# Altium schematic sheet Power.SchDoc: M1 Test Fixture Board
size Legal; Author: Leo Buchman; Revision: B; SheetNumber: 4; SheetTotal: 4
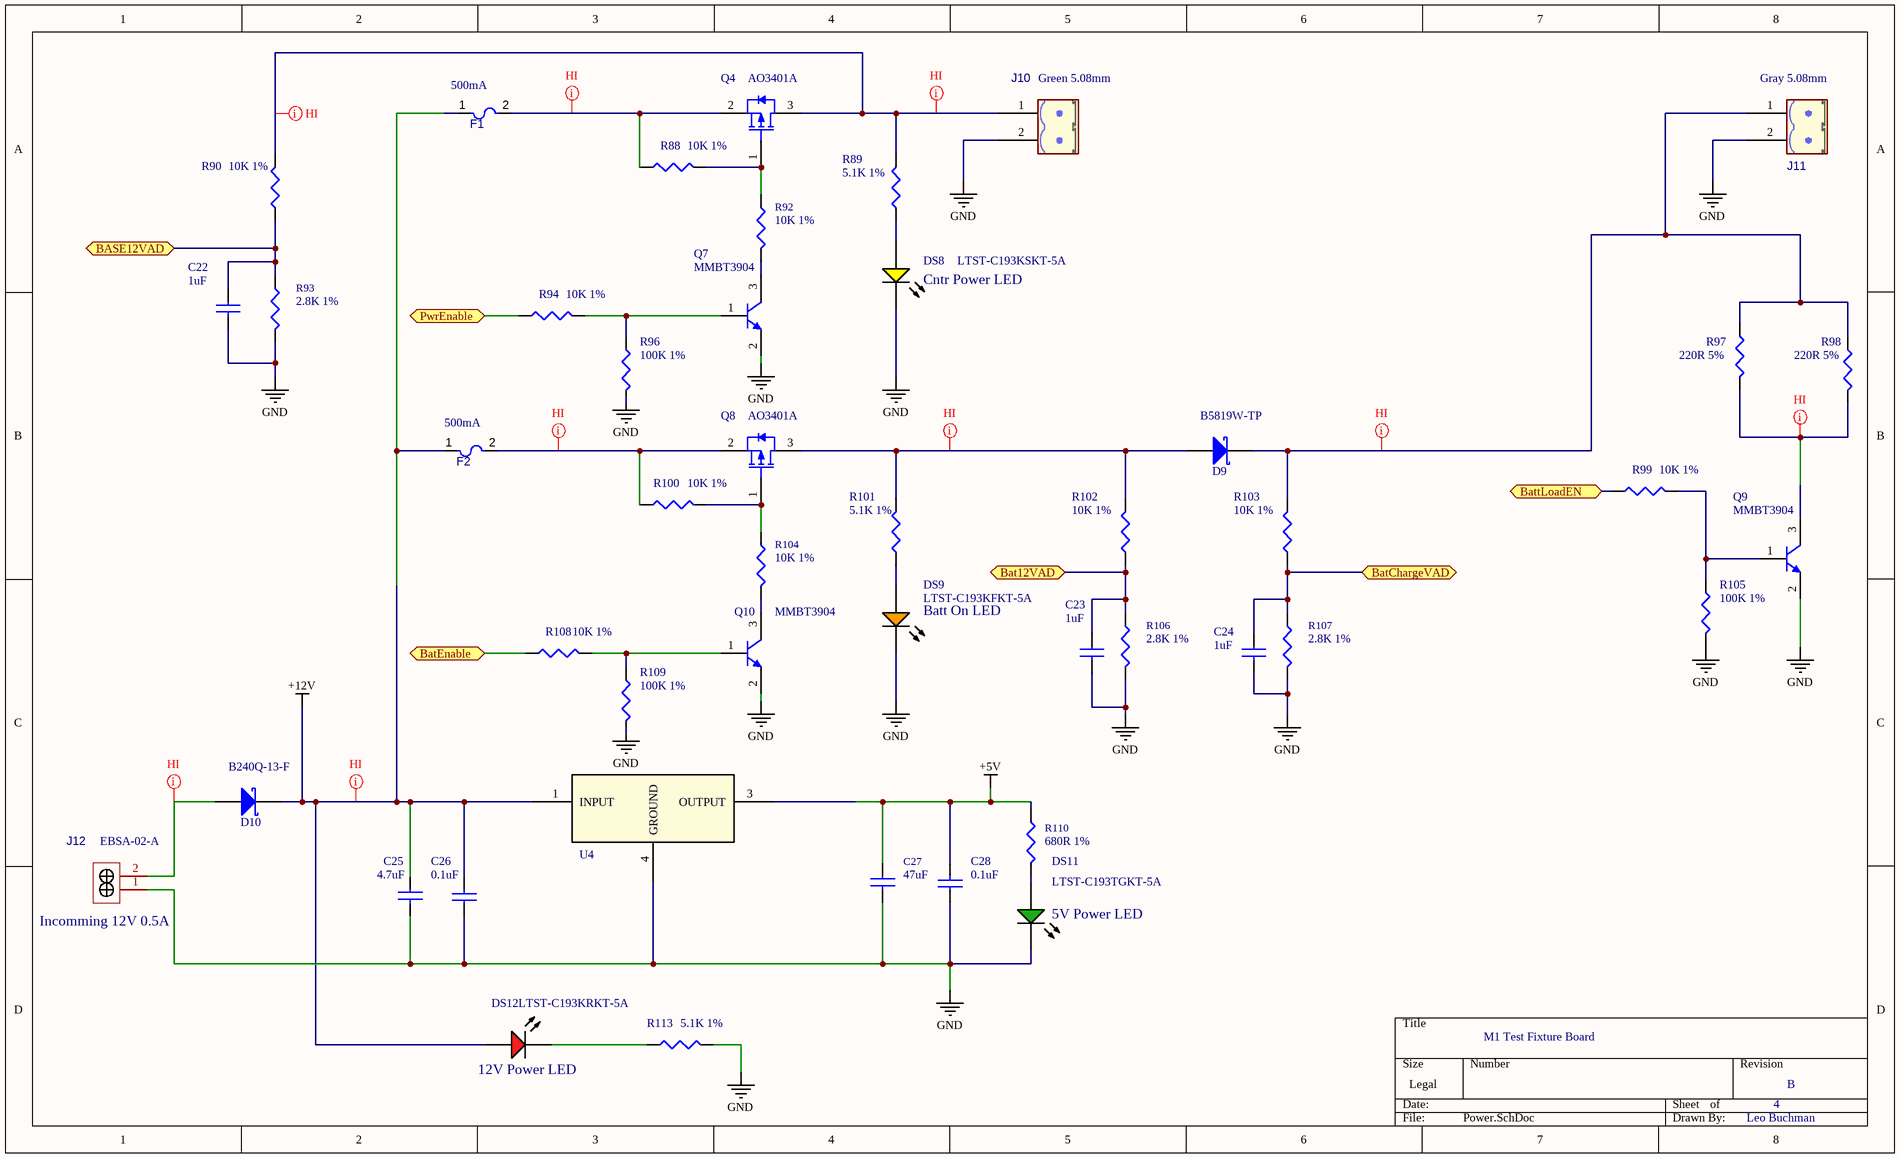
[diagram p0: Power.SchDoc]

## Parts
C22  1uF  [C0402]
C23  1uF  [C0402]
C24  1uF  [C0402]
C25  4.7uF  [C0603]
C26  0.1uF  [C0402]
C27  47uF  [C1210]
C28  0.1uF  [C0402]
D9  B5819W-TP  [MCC-SOD123_V]
D10  B240Q-13-F  [DIODE_DO214AA]
DS8  LTST-C193KSKT-5A  [LED-YELLOW_0603]
DS9  LTST-C193KFKT-5A  [LED-ORANGE_0603]
DS11  LTST-C193TGKT-5A  [LED-GREEN_0603]
DS12  LTST-C193KRKT-5A  [LED-RED_0603]
F1  500mA  [FUSE_F050-2]
F2  500mA  [FUSE_F050-2]
J10  Green 5.08mm  [Conn_5433668]
J11  Gray 5.08mm  [Conn_5442002]
J12  EBSA-02-A  [CONN-TH_2P-P3.50_JL15EDGRC-35002G01]
Q4  AO3401A  [AO-SOT-23-3L_V]
Q7  MMBT3904  [sot23-3]
Q8  AO3401A  [AO-SOT-23-3L_V]
Q9  MMBT3904  [sot23-3]
Q10  MMBT3904  [sot23-3]
R88  10K 1%  [R0402]
R89  5.1K 1%  [R0402]
R90  10K 1%  [R0402]
R92  10K 1%  [R0402]
R93  2.8K 1%  [R0402]
R94  10K 1%  [R0402]
R96  100K 1%  [R0402]
R97  220R 5%  [RESC6331X75N]
R98  220R 5%  [RESC6331X75N]
R99  10K 1%  [R0402]
R100  10K 1%  [R0402]
R101  5.1K 1%  [R0402]
R102  10K 1%  [R0402]
R103  10K 1%  [R0402]
R104  10K 1%  [R0402]
R105  100K 1%  [R0402]
R106  2.8K 1%  [R0402]
R107  2.8K 1%  [R0402]
R108  10K 1%  [R0402]
R109  100K 1%  [R0402]
R110  680R 1%  [R0402]
R113  5.1K 1%  [R0402]
U4  L7805CD2T-TR  [VREG_L7805ACD2T]  (value not drawn)

## Ports
BASE12VAD (bidir), Bat12VAD (bidir), BatChargeVAD (bidir), BatEnable (bidir), BattLoadEN (bidir), PwrEnable (bidir)

## Nets
+5V: C27.1 C28.2 R110.1 U4.3(OUTPUT)
+12V: C25.1 C26.2 D10.2(K) DS12.1(A) F1.1 F2.1 U4.1(INPUT)
GND: C22.2 C23.2 C24.2 C25.2 C26.1 C27.2 C28.1 DS8.2(K) DS9.2(K) DS11.2(K) J10.2 J11.2 J12.1 Q7.2(E) Q9.2(E) Q10.2(E) R93.2 R96.2 R105.2 R106.2 R107.2 R109.2 R113.2 U4.4(GROUND)
BASE12VAD: C22.1 R90.1 R93.1 ; port BASE12VAD
Bat12VAD: C23.1 R102.1 R106.1 ; port Bat12VAD
BatChargeVAD: C24.1 R103.1 R107.1 ; port BatChargeVAD
BatEnable: R108.1 ; port BatEnable
BattLoadEN: R99.1 ; port BattLoadEN
PwrEnable: R94.1 ; port PwrEnable
NetD9_1: D9.1(A) Q8.3(DRAIN) R101.2 R102.2
NetD9_2: D9.2(K) J11.1 R97.1 R98.1 R103.2
NetD10_1: D10.1(A) J12.2
NetDS8_1: DS8.1(A) R89.1
NetDS9_1: DS9.1(A) R101.1
NetDS11_1: DS11.1(A) R110.2
NetDS12_2: DS12.2(K) R113.1
NetF1_2: F1.2 Q4.2(SOURCE) R88.1
NetF2_2: F2.2 Q8.2(SOURCE) R100.1
NetJ10_1: J10.1 Q4.3(DRAIN) R89.2 R90.2
NetQ4_1: Q4.1(GATE) R88.2 R92.1
NetQ7_1: Q7.1(B) R94.2 R96.1
NetQ7_3: Q7.3(C) R92.2
NetQ8_1: Q8.1(GATE) R100.2 R104.1
NetQ9_1: Q9.1(B) R99.2 R105.1
NetQ9_3: Q9.3(C) R97.2 R98.2
NetQ10_1: Q10.1(B) R108.2 R109.1
NetQ10_3: Q10.3(C) R104.2

## Layout directives
net class HI: +12V, NetD9_1, NetD9_2, NetD10_1, NetF1_2, NetF2_2, NetJ10_1, NetQ9_3

## Notes on the sheet
- (near DS8) Cntr Power LED
- (near DS9) Batt On LED
- (near J12) Incomming 12V 0.5A
- (near DS11) 5V Power LED
- (near DS12) 12V Power LED

## Library data of the parts
C22-C24 = Cap-00003: CAP CER 1UF 10V Y5V 0402; Manufacturer: KEMET; Manufacturer Part Number: C0402C105Z8VAC7867; Tolerance: 80%; Dielectric Material: Ceramic; Part Name: Cap-00003; Supplier 1: Digi-Key; Supplier Part Number 1: 399-14873-1-ND; RoHS: Yes; Category: Ceramic Capacitors; Stock 1: 9702; Pricing 1: 1=0.28000, 10=0.18900, 50=0.12580, 100=0.1070; Mount: Surface Mount; Case/Package: 0402; Case Code (Metric): 1005; Case Code (Imperial): 0402; Min Operating Temperature: -30°C; Max Operating Temperature: 85°C; Packaging: Cut Tape; Capacitance: 1uF; Voltage Rating: 10V; ComponentLink1URL: https://api.kemet.com/component-edge/download; ComponentLink1Description: https://api.kemet.com/component-edge/download; LCSC Part Number: C52923; Number of Pins: 2; Termination: SMD/SMT
C25 = Cap-00001: CAP CER 4.7UF 16V X5R 0603; Manufacturer: Samsung; Manufacturer Part Number: CL10A475KO8NNNC; Material: Ceramic; Tolerance: 10%; Part Name: Cap-00001; Supplier 1: Digi-Key; Supplier Part Number 1: 1276-1784-1-ND; RoHS: Yes; Category: Ceramic Capacitors; Stock 1: 1593998; Pricing 1: 1=0.13000, 10=0.09100, 50=0.05180, 100=0.0429; Mount: Surface Mount; Case/Package: 0603; Case Code (Metric): 1608; Case Code (Imperial): 0603; Contact Plating: Tin; Min Operating Temperature: -55°C; Max Operating Temperature: 85°C; Packaging: Tape and Reel; Package Quantity: 1; Capacitance: 4.7uF; Voltage Rating: 16V; Dielectric: X5R; Voltage: 16V; Series: CL; Construction: Flat; Length: 1.6mm; Width: 0.031inch; Height: 0.8mm; Thickness: 0.035inch; Depth: 0.8mm; Radiation Hardening: No; RoHS Compliant: Yes; ComponentLink1URL: https://datasheet.ciiva.com/25795/cl10a475ko8; ComponentLink1Description: https://datasheet.ciiva.com/25795/cl10a475ko8; ComponentLink2URL: https://datasheet.ciiva.com/26838/getdatashee; ComponentLink2Description: https://datasheet.ciiva.com/26838/getdatashee; ComponentLink3URL: https://datasheet.ciiva.com/29198/457663-da-0; ComponentLink3Description: https://datasheet.ciiva.com/29198/457663-da-0; LCSC Part Number: C19666; Dielectric Material: Ceramic; Number of Pins: 2; Termination: SMD/SMT
C26 C28 = Cap-00005: Cap Ceramic 0.1uF 50V X7R 10% Pad SMD 0402 125C Automotive T/R; Manufacturer: Murata; Manufacturer Part Number: GRT155R71H104KE01D; Part Name: Cap-00005; Supplier 1: Digi-Key; Supplier Part Number 1: 490-GRT155R71H104KE01DCT-ND; RoHS: Yes; Category: Ceramic Capacitors; Stock 1: 179948; Pricing 1: 1=0.10000, 10=0.04700, 50=0.02580, 100=0.0211; Mount: Surface Mount; Case/Package: 0402; Case Code (Metric): 1005; Case Code (Imperial): 0402; RoHS Compliant: Yes; LCSC Part Number: C307331; Number of Pins: 2; Dielectric Material: Ceramic; Termination: SMD/SMT; Voltage Rating (DC): 50V
C27 = Cap-00004: CAP CER 47UF 16V X5R 1210; Manufacturer: Murata; Manufacturer Part Number: GRM32ER61C476ME15L; Tolerance: 20%; Dielectric Material: Ceramic; Part Name: Cap-00004; Supplier 1: Digi-Key; Supplier Part Number 1: 490-3888-1-ND; RoHS: Yes; Category: Ceramic Capacitors; Stock 1: 238447; Pricing 1: 1=0.73000, 10=0.53900, 50=0.43120, 100=0.3697; Mount: Surface Mount; Case/Package: 1210; Case Code (Metric): 3225; Case Code (Imperial): 1210; Min Operating Temperature: -55°C; Max Operating Temperature: 85°C; Packaging: Tape and Reel; Package Quantity: 1000; Capacitance: 47uF; Voltage Rating: 16V; Dielectric: X5R; Voltage: 16V; Series: GRM; Length: 3.2mm; Width: 0.098inch; Height: 2.5mm; Thickness: 0.106inch; Depth: 2.5mm; RoHS Compliant: Yes; ComponentLink1URL: https://datasheet.ciiva.com/141/product-14197; ComponentLink1Description: https://datasheet.ciiva.com/141/product-14197; ComponentLink2URL: https://datasheet.ciiva.com/14116/grm32er61c4; ComponentLink2Description: https://datasheet.ciiva.com/14116/grm32er61c4; ComponentLink3URL: https://datasheet.ciiva.com/7719/415303-77191; ComponentLink3Description: https://datasheet.ciiva.com/7719/415303-77191; LCSC Part Number: C77101; Number of Pins: 2; Termination: SMD/SMT; REACH SVHC: No SVHC; Lead Free: Lead Free; ComponentLink4URL: https://datasheet.ciiva.com/141/partnumbering; ComponentLink4Description: https://datasheet.ciiva.com/141/partnumbering; ComponentLink5URL: https://datasheet.ciiva.com/141/partnumbering; ComponentLink5Description: https://datasheet.ciiva.com/141/partnumbering; ComponentLink6URL: https://datasheet.ciiva.com/16343/c02e-163436; ComponentLink6Description: https://datasheet.ciiva.com/16343/c02e-163436; Voltage Rating (DC): 16V
D9 = Diode-0002: DIODE SCHOTTKY 40V 1A SOD323; Manufacturer: MCC; Manufacturer Part Number: B5819W TP; Forward Current: 25mA; Forward Voltage: 600mV @ 1A; Color: Blue; Dominant Wavelength: 470nm; Lens Style: Diffused,Colorless,Rectangular,Clear; Luminous Intensity: 28.5mcd; Number of Elements: 1; Power Dissipation: 110W; Reverse Voltage: 5V; Test Current: 20mA; Viewing Angle: 120°; Datasheet Version: Rev. B, 01/2013; Max Operating Temperature: 85°C; RoHS Compliant: Yes; Min Operating Temperature: -40°C; Manufacturer URL: http://www.mccsemi.com/; Package URL: http://www.mccsemi.com/up_pdf/1N4448W(SOD-123).pdf; Case/Package: sod123; Mounting Technology: SM; Datasheet URL: http://www.mccsemi.com/up_pdf/B5817W-B5819W(SOD-123).pdf; Package Description: 2-Pin Small Outline Diode, Body 2.7 x 1.6 mm, Height 1.35 mm; Package Reference: SOD123; Component Type: Diodes; Part Name: Diode-0002; Supplier 1: Digi-Key; Supplier Part Number 1: 5819W-TPMSTR-ND; RoHS: Yes; Category: Rectifier Diodes; Stock 1: 237825; Pricing 1: 1=0.47000, 10=0.35200, 100=0.19930, 500=0.132; Mount: Surface Mount; Case Code (Imperial): sod123; Packaging: Tape and Reel; Max Reverse Voltage (DC): 40V; Average Rectified Current: 1A; ComponentLink1URL: https://datasheet.ciiva.com/16302/19-217-bhc-; ComponentLink1Description: https://datasheet.ciiva.com/16302/19-217-bhc-; ComponentLink2URL: https://datasheet.ciiva.com/26901/getdatashee; ComponentLink2Description: https://datasheet.ciiva.com/26901/getdatashee; Radiation Hardening: No; Lead Free: Lead Free; Depth: 0.8mm; LCSC Part Number: C84354; Length: 1.6mm; Number of LEDs: 1
D10 = Diode-0008: Rectifier Diode Schottky 40V 2A Automotive 2-Pin SMB T/R; Manufacturer: Diodes; Manufacturer: MCC; Forward Current: 200mA; Forward Voltage: 800mV; Max Reverse Voltage (DC): 30V; Peak Non-Repetitive Surge Current: 600mA; Power Dissipation: 200mW; Max Reverse Current: 2uA; Capacitance: 10pF; Reverse Recovery Time: 5ns; Datasheet Version: Rev. B, 01/2013; Max Operating Temperature: 150°C; RoHS Compliant: Yes; Min Operating Temperature: -65°C; Manufacturer URL: http://www.mccsemi.com/; Package URL: http://www.mccsemi.com/up_pdf/1N4448W(SOD-123).pdf; Case/Package: SMB; Mounting Technology: SM; Datasheet URL: http://www.mccsemi.com/up_pdf/B5817W-B5819W(SOD-123).pdf; Package Description: 2-Pin Small Outline Diode, Body 2.7 x 1.6 mm, Height 1.35 mm; Package Reference: SOD123; Manufacturer Part Number: B240Q-13-F; Component Type: Diodes; Part Name: Diode-0008; Supplier 1: Digi-Key; Supplier Part Number 1: B240Q-13-FDICT-ND; RoHS: Yes; Category: Rectifier Diodes; Stock 1: 9228; Pricing 1: 1=0.40000, 10=0.32600, 100=0.22180, 500=0.166; Mount: Surface Mount; Packaging: Tape and Reel; Average Rectified Current: 200mA; ComponentLink1URL: https://datasheet.ciiva.com/34302/1539235-343; ComponentLink1Description: https://datasheet.ciiva.com/34302/1539235-343; ComponentLink2URL: https://datasheet.ciiva.com/22695/1911820-226; ComponentLink2Description: https://datasheet.ciiva.com/22695/1911820-226; ComponentLink3URL: https://datasheet.ciiva.com/15144/getdatashee; ComponentLink3Description: https://datasheet.ciiva.com/15144/getdatashee; Number of Pins: 2; Package Quantity: 3000; Series: -; Radiation Hardening: No; Lead Free: Lead Free; LCSC Part Number: C460673; Length: 2.9mm; Width: 1.3mm; Height: 1mm; Power Rating: 200mW; Contact Plating: Tin,Matte; Max Repetitive Reverse Voltage (Vrrm): 30V; Current Rating: 200mA; Max Forward Surge Current (Ifsm): 600mA; Max Power Dissipation: 200mW; REACH SVHC: No SVHC; Termination: SMD/SMT; Voltage Rating (DC): 30V; Weight: 0.000282oz
DS8 = Diode-0006: LED Yellow CLEAR 0603 SMD; Manufacturer: Vishay Lite-On; Voltage Rating: 50 V; Power Rating: 75mW; Case\Package: 0603; Resistance: 390 Ohm; Forward Voltage: 2.0V; Lens Style: Diffused,Colorless,Rectangular; Viewing Angle: 130°; Forward Current: 30mA; Luminous Intensity: 45mcd; Dominant Wavelength: 594.5nm; Number of Elements: 1; Test Current: 5mA; Reverse Voltage: 5V; Lens Color: Colorless; Min Operating Temperature: -55°C; Length: 1.6mm; ComponentLink3Description: https://datasheet.ciiva.com/26890/getdatashee; Mount: Surface Mount; PackageReference: HSMX-C190; ComponentLink2Description: https://datasheet.ciiva.com/4688/lite-on-ltst; DatasheetVersion: Mar-12; Case Code (Metric): 1608; Pins: 2; Package Quantity: 1; ComponentLink2URL: https://datasheet.ciiva.com/4688/lite-on-ltst; ComponentLink1Description: https://datasheet.ciiva.com/11775/0900766b80d; RoHSCompliant: true; Packaging: Tape and Reel; PackageDescription: 2-Pin Surface Mount Device, Body 1.6 x 0.8 mm, Height 0.9 mm; ComponentLink3URL: https://datasheet.ciiva.com/26890/getdatashee; Width: 0.8mm; ComponentLink1URL: https://datasheet.ciiva.com/11775/0900766b80d; Max Operating Temperature: 85°C; Case Code (Imperial): 0603; Height: 0.35mm; Manufacturer Part Number: LTST-C193KSKT-5A; Part Name: Diode-0006; Supplier 1: Digi-Key; Supplier Part Number 1: 160-1831-1-ND; RoHS: Yes; Category: LEDs; Stock 1: 147319; Pricing 1: 1=0.39000, 10=0.20900, 100=0.09720, 500=0.089; Case/Package: 0603; RoHS Compliant: Yes; Number of Pins: 2; Radiation Hardening: No; Lead Free: Lead Free; ComponentLink4URL: https://datasheet.ciiva.com/2110/s-110-ltst-c; ComponentLink4Description: https://datasheet.ciiva.com/2110/s-110-ltst-c; ComponentLink5URL: https://datasheet.ciiva.com/2110/s-110-ltst-c; ComponentLink5Description: https://datasheet.ciiva.com/2110/s-110-ltst-c; ComponentLink6URL: https://datasheet.ciiva.com/2110/s-110-ltst-c; ComponentLink6Description: https://datasheet.ciiva.com/2110/s-110-ltst-c; ComponentLink7URL: https://datasheet.ciiva.com/2110/ltst-c193kfk; ComponentLink7Description: https://datasheet.ciiva.com/2110/ltst-c193kfk; LCSC Part Number: C72038; Color: Yellow; Power Dissipation: 75mW; Number of LEDs: 1; Depth: 0.8mm; Illumination Color: Yellow; Lens Transparency: Clear
DS9 = Diode-0004: LED Orange CLEAR 0603 SMD; Manufacturer: Vishay Lite-On; Manufacturer: Rohm; Viewing Angle: 130°; Forward Voltage: 2.0V; Forward (Drive) Current: 20mA; Intensity: 22mcd; Lens Style: Diffused,Colorless,Rectangular,Clear; Forward Current: 5mA; Luminous Intensity: 28.1mcd; Dominant Wavelength: 605nm; Number of Elements: 1; Lens Color: Colorless; Lens Type: Clear; Datasheet Version: Rev. 2.0, 03/2010; Package Description: 2-Pin Surface Mount Device, Body 1.6 x 0.8 mm; Mounting Technology: SurfaceMount; Dimension: 1.6x0.8x0.36mm; Package Reference: 1608; Datasheet URL: https://datasheet.ciiva.com/11773/0900766b80df3ad8-11773825.pdf; Color: Orange; Manufacturer URL: http://www.rohm.com/web/global/; Manufacturer Part Number: LTST-C193KFKT-5A; Part Name: Diode-0004; Supplier 1: Digi-Key; Supplier Part Number 1: 160-1829-1-ND; RoHS: Yes; Category: LEDs; Stock 1: 55639; Pricing 1: 1=0.39000, 10=0.20900, 100=0.09720, 500=0.089; Mount: Surface Mount; Case/Package: 0603; Case Code (Imperial): 0603; Case Code (Metric): 1608; Packaging: Tape and Reel; RoHS Compliant: Yes; Number of Pins: 2; Min Operating Temperature: -55°C; Max Operating Temperature: 85°C; Radiation Hardening: No; Lead Free: Lead Free; LCSC Part Number: C434425; Illumination Color: Orange; Lens Transparency: Clear; Width: 0.8mm; Height: 0.35mm
DS11 = Diode-0007: LED Green CLEAR 0603 SMD; Manufacturer: Vishay Lite-On; Frequency: 400 KHz; Max Supply Voltage: 5.5 V; Access Time: 3500 ns; Clock Frequency: 100 KHz; Case\Package: SOIC; Density: 32 kb; Nominal Supply Current: 2 mA; Min Supply Voltage: 1.7 V; Max Reverse Voltage (DC): 40V; Average Rectified Current: 2A; Forward Voltage: 2.0V; Element Configuration: Single; Peak Non-Repetitive Surge Current: 50A; Lens Style: Diffused,Colorless,Rectangular; Viewing Angle: 130°; Forward Current: 5mA; Luminous Intensity: 280mcd; Dominant Wavelength: 535nm; Number of Elements: 1; Power Dissipation: 76mW; Reverse Voltage: 5V; Lens Color: Colorless; Max Reverse Current: 500uA; Packaging: Tape and Reel; PackageReference: HSMX-C190; ComponentLink2URL: https://datasheet.ciiva.com/11775/0900766b80d; RoHSCompliant: true; Pins: 8; Max Operating Temperature: 80°C; Width: 0.8mm; Radiation Hardening: No; Package Quantity: 3000; ComponentLink3Description: https://datasheet.ciiva.com/4689/lite-on-ltst; ComponentLink1Description: https://datasheet.ciiva.com/2111/ltst-c193tgk; Min Operating Temperature: -20°C; PackageDescription: 2-Pin Surface Mount Device, Body 1.6 x 0.8 mm, Height 0.9 mm; Max Clock Frequency: 100 KHz; Height: 0.35mm; ComponentLink1URL: https://datasheet.ciiva.com/2111/ltst-c193tgk; DatasheetVersion: Mar-12; ComponentLink2Description: https://datasheet.ciiva.com/11775/0900766b80d; Mount: Surface Mount; Length: 1.6mm; ComponentLink3URL: https://datasheet.ciiva.com/4689/lite-on-ltst; Manufacturer Part Number: LTST-C193TGKT-5A; Part Name: Diode-0007; Supplier 1: Digi-Key; Supplier Part Number 1: 160-1832-1-ND; RoHS: Yes; Category: LEDs; Stock 1: 429188; Pricing 1: 1=0.45000, 10=0.27400, 100=0.15780, 1000=0.12; Case/Package: 0603; Case Code (Imperial): 0603; Case Code (Metric): 1608; RoHS Compliant: Yes; Number of Pins: 2; Series: -; Lead Free: Lead Free; ComponentLink4URL: https://datasheet.ciiva.com/2111/p-100-ltst-c; ComponentLink4Description: https://datasheet.ciiva.com/2111/p-100-ltst-c; ComponentLink5URL: https://datasheet.ciiva.com/2111/p-100-ltst-c; ComponentLink5Description: https://datasheet.ciiva.com/2111/p-100-ltst-c; ComponentLink6URL: http://www.mouser.com/ds/2/115/B220AQ_Q-B260A; ComponentLink6Description: http://www.mouser.com/ds/2/115/B220AQ_Q-B260A; ComponentLink7URL: https://www.diodes.com/assets/Datasheets/ds13; ComponentLink7Description: https://www.diodes.com/assets/Datasheets/ds13; ComponentLink8URL: http://www.diodes.com/datasheets/ds13004.pdf?; ComponentLink8Description: http://www.diodes.com/datasheets/ds13004.pdf?; LCSC Part Number: C72043; Color: Green; Test Current: 5mA; Number of LEDs: 1; Depth: 0.8mm; Illumination Color: Green; Lens Transparency: Clear; Contact Plating: Tin,Matte; Max Repetitive Reverse Voltage (Vrrm): 40V
DS12 = Diode-0005: LED RED CLEAR 0603 SMD; Manufacturer: Vishay Lite-On; Manufacturer: Broadcom Avago; Type: Uni-Color; Product Height (mm): 1.1mm; Power Dissipation: 50mW; Product Length (mm): 3.2mm; Forward Voltage: 2.0V; Luminous Intensity: 45mcd; DELETED: Compliant; Shape Type: Rectangular; Peak Wavelength: 660nm; Main Category: ChipLED; Dominant Wave Length: 639nm; Rad Hardened: No; Lens Type: ColorlessDiffused; Product Depth (mm): 1.6mm; Reverse Voltage: 5V; Forward Current: 5mA; Chip Material: GaAlAs; Test Current (It): 20mA; Lum Intensity: 17mcd; Viewing Angle: 130°; Number of  Elements: 1; Lens Style: Diffused,Colorless,Clear,Rectangular; Dominant Wavelength: 631nm; Lens Color: Colorless; Package Reference: HSMX-C150; Package Description: 2-Pin Surface Mount Device, Body 3.2 x 1.6 mm; Operating Temp Range: -40Cto85C; Mounting: SurfaceMount; Emitting Color: Red; Pin Count: 2; Operating Temperature Classification: Industrial; Datasheet URL: http://media.digikey.com/pdf/Data%20Sheets/Avago%20PDFs/HSMz-Czzz.pdf; Package Type: ChipLed; Mounting Technology: SurfaceMount; High Brightness: No; Lens Dimensions: 2x1.6x0.6mm; Manufacturer URL: http://www.avagotech.com/; Datasheet Version: 03/2012; Packaging: Tape and Reel; Manufacturer Part Number: LTST-C193KRKT-5A; Part Name: Diode-0005; Supplier 1: Digi-Key; Supplier Part Number 1: 160-1830-1-ND; RoHS: Yes; Category: LEDs; Stock 1: 476214; Pricing 1: 1=0.39000, 10=0.20900, 100=0.09720, 500=0.089; Mount: Surface Mount; Case/Package: 0603; Case Code (Imperial): 0603; Case Code (Metric): 1608; RoHS Compliant: Yes; ComponentLink1URL: https://datasheet.ciiva.com/11775/0900766b80d; ComponentLink1Description: https://datasheet.ciiva.com/11775/0900766b80d; ComponentLink2URL: https://datasheet.ciiva.com/4689/100-ltst-c19; ComponentLink2Description: https://datasheet.ciiva.com/4689/100-ltst-c19; ComponentLink3URL: https://datasheet.ciiva.com/16210/ltst-c193kr; ComponentLink3Description: https://datasheet.ciiva.com/16210/ltst-c193kr; Number of Pins: 2; Min Operating Temperature: -55°C; Max Operating Temperature: 85°C; Package Quantity: 3000; Series: -; Radiation Hardening: No; Lead Free: Lead Free; ComponentLink4URL: https://datasheet.ciiva.com/2110/s-110-ltst-c; ComponentLink4Description: https://datasheet.ciiva.com/2110/s-110-ltst-c; LCSC Part Number: C2286; Color: Red; Number of Elements: 1; Test Current: 5mA; Number of LEDs: 1; Length: 1.6mm; Depth: 0.8mm; Illumination Color: Red; Lens Transparency: Clear; Width: 0.8mm; Height: 0.35mm
F1 F2 = MF-MSMF050-2: 15VDC 500mA; Manufacturer: Bourns; Current Rating: 100A; Number of Terminals/Pins: 2; Trip Current: 1A; Voltage Rating: 15V; Resistance: 150mR; Power Dissipation: 800mW; Time to Trip: 0.15s; Aging: 1000 hr @ +85 °C (Passive); Approvals: UL,CSA,TUV; Case/Package: 1812; Package Reference: MF-MSMF050-2; Package Description: 2-Pin Surface Mount Device, Body 4.55 x 3.24 mm; Mounting Technology: SM; Datasheet Version: Rev. AG, 08/2016; Min Operating Temperature: -40°C; Max Operating Temperature: 85°C; RoHS Compliant: Yes; Packaging: Tape and Reel; Datasheet URL: http://www.bourns.com/data/global/pdfs/mfmsmf.pdf; Manufacturer Part Number: MF-MSMF050-2; Component Type: Fuses; Part Name: MF-MSMF050-2; Supplier 1: Digi-Key; Supplier Part Number 1: MF-MSMF050-2CT-ND; RoHS: Yes; Category: PTC Resettable Fuses; Stock 1: 59686; Pricing 1: 1=0.32000, 5=0.31000, 10=0.29500, 50=0.26360,; Mount: Surface Mount,PCB; Number of Pins: 2; Case Code (Metric): 4532; Case Code (Imperial): 1812; Contact Plating: Gold; Terminal Material: Gold; Package Quantity: 2000; Max Current Rating: 100A; Hold Current: 500mA; Series: MF-MSMF; Operating Supply Voltage: 15V; Termination: SMD/SMT; Voltage Rating (DC): 15V; Length: 4.73mm; Width: 3.41mm; Height: 0.85mm; Radiation Hardening: No; REACH SVHC: No SVHC; Lead Free: Lead Free; ComponentLink1URL: https://datasheet.ciiva.com/34302/1164200-343; ComponentLink1Description: https://datasheet.ciiva.com/34302/1164200-343; ComponentLink2URL: https://datasheet.ciiva.com/1228/1786007-1228; ComponentLink2Description: https://datasheet.ciiva.com/1228/1786007-1228; ComponentLink3URL: https://datasheet.ciiva.com/32426/mf-msmf-ser; ComponentLink3Description: https://datasheet.ciiva.com/32426/mf-msmf-ser; ComponentLink4URL: https://datasheet.ciiva.com/22749/1695373-227; ComponentLink4Description: https://datasheet.ciiva.com/22749/1695373-227; ComponentLink5URL: https://datasheet.ciiva.com/46395/1695373-463; ComponentLink5Description: https://datasheet.ciiva.com/46395/1695373-463; ComponentLink6URL: https://datasheet.ciiva.com/4501/mfmsmf-72300; ComponentLink6Description: https://datasheet.ciiva.com/4501/mfmsmf-72300; ComponentLink7URL: https://datasheet.ciiva.com/14537/70153434-14; ComponentLink7Description: https://datasheet.ciiva.com/14537/70153434-14; ComponentLink8URL: https://datasheet.ciiva.com/1274/1786007-1274; ComponentLink8Description: https://datasheet.ciiva.com/1274/1786007-1274; ComponentLink9URL: https://datasheet.ciiva.com/1274/1786007-1274; ComponentLink9Description: https://datasheet.ciiva.com/1274/1786007-1274; ComponentLink10URL: https://datasheet.ciiva.com/3019/mfmsmf-30196; ComponentLink10Description: https://datasheet.ciiva.com/3019/mfmsmf-30196; ComponentLink11URL: https://datasheet.ciiva.com/16205/mfmsmf-1620; ComponentLink11Description: https://datasheet.ciiva.com/16205/mfmsmf-1620; ComponentLink12URL: https://datasheet.ciiva.com/15226/getdatashee; ComponentLink12Description: https://datasheet.ciiva.com/15226/getdatashee; ComponentLink13URL: https://datasheet.ciiva.com/3019/mfmsmf-30196; ComponentLink13Description: https://datasheet.ciiva.com/3019/mfmsmf-30196; ComponentLink14URL: https://datasheet.ciiva.com/326/mfmsmf-326355; ComponentLink14Description: https://datasheet.ciiva.com/326/mfmsmf-326355; ComponentLink15URL: https://datasheet.ciiva.com/326/mfmsmf-326356; ComponentLink15Description: https://datasheet.ciiva.com/326/mfmsmf-326356; ComponentLink16URL: https://datasheet.ciiva.com/326/mfmsmf-326354; ComponentLink16Description: https://datasheet.ciiva.com/326/mfmsmf-326354; LCSC Part Number: C17313
J10 = CON-0006: Pluggable Term Blocks BCH-508HS- 2 GN 5.08; Manufacturer: Phoenix Contact; Manufacturer Part Number: 5442002; ATTR: HEADER TERM BLK 5.08MM 2POS RTA GRAY; PKG: TB508HDR02_RTA; Connector Type: Screw; Number of Positions: 3; Pitch: 3.5mm; Current Rating: 13.5A; Voltage Rating: 200V; Gender: Male; Number of Levels: 1; Voltage: 300V; Approvals: UL,CSA,cULus,CB,EAC; Stripping Length: 5mm; Wire/Cable Gauge: 30AWG; Wire Gauge (Min): 16AWG; Part Name: CON-0006; Supplier 1: Digi-Key; Supplier Part Number 1: 277-11311-ND; RoHS: Yes; Stock 1: 219; Pricing 1: 1=0.68000, 10=0.64900, 50=0.63140, 100=0.5900; LCSC Part Number: N/A; Category: Terminal Blocks; Mount: Through Hole; Contact Material: Tin; Packaging: Bulk; Number of Rows: 1; Termination: Screw; ComponentLink1URL: https://datasheet.ciiva.com/16046/1751251-160; ComponentLink1Description: https://datasheet.ciiva.com/16046/1751251-160; Package Quantity: 50; Series: COMBICON MKDS; RoHS Compliant: Yes; Number of Contacts: 3; REACH SVHC: Unknown; Lead Free: Lead Free; ComponentLink2URL: https://datasheet.ciiva.com/6745/1751251-6745; ComponentLink2Description: https://datasheet.ciiva.com/6745/1751251-6745; ComponentLink3URL: https://datasheet.ciiva.com/29226/774163-da-0; ComponentLink3Description: https://datasheet.ciiva.com/29226/774163-da-0; Flammability Rating: UL94 V-0; Number of Positions Per Level: 3; Max Current Rating: 13.5A; Orientation: Straight; Length: 7.3mm; Current: 13.5A; Housing Color: Green; Number of Poles: 3; Height: 11mm; Insulation Material: Nylon; Material: Polyamide; Number of Circuits: 3; Weight: 0.056791oz; Width: 12mm; Wire Gauge (Max): 30AWG
J11 = CON-0005: Pluggable Term Blocks BCH-508HS- 2 GR 5.08; Manufacturer: Phoenix Contact; Manufacturer Part Number: 5433668; PKG: TB508HDR02_RTA; ATTR: HEADER TERM BLK 5.08MM 2POS RTA GREEN; Current Rating: 12A; Voltage Rating: 320V; Number of Positions Per Level: 2; Number of Levels: 1; Part Name: CON-0005; Supplier 1: Digi-Key; Supplier Part Number 1: 277-11218-ND; RoHS: Yes; Stock 1: 100; Pricing 1: 1=0.69000, 10=0.66000, 50=0.64200, 100=0.6000; LCSC Part Number: N/A; Category: Terminal Blocks; Mount: Through Hole; Color: Grey; Contact Plating: Tin; Packaging: Bulk; Termination: Solder; Package Quantity: 100
J12 = CON-0001: Conn Header Right angle 3.5 pitch 2P; Manufacturer: Adam Equipment; Connector Type: Male Pin; Number of Positions: 6; Pitch: 0.1inch; Part Name: CON-0001; Supplier 1: Digi-Key; Supplier Part Number 1: 2057-EBSA-02-A-ND; Manufacturer Part Number: EBSA-02-A; RoHS: Yes; Stock 1: 2090; Pricing 1: 1=0.58000, 10=0.31600, 25=0.23600, 50=0.21040; LCSC Part Number: C409115; Category: Connectors; Color: Black; ComponentLink1Description: https://datasheet.ciiva.com/741/xrxczzzsxxn-r; ComponentLink1URL: https://datasheet.ciiva.com/741/xrxczzzsxxn-r; Contact Mating Length: 0.318inch; Contact Plating: Gold; Contact Type: Male Pin; Mount: Through Hole; Number of Rows: 1; Package Quantity: 1; Packaging: Bulk; Pricing 2: 1=0.21000, 10=0.19800, 25=0.16920, 50=0.14820; RoHS Compliant: Yes; Series: -; Stock 2: 1241; Supplier 2: Digi-Key; Supplier Part Number 2: S1211EC-06-ND; Termination: Solder
Q4 Q8 = Tran-0001: Mosfet P-channel 30V 4A SOT23-3; Manufacturer: Alpha & Omega Semiconductor; Manufacturer Part Number: AO3401AL; Output Power (Max): NotRequiredW; Power Dissipation: 350mW; Rad Hardened: No; Drain Efficiency: NotRequired%; Noise Figure: NotRequireddB; Frequency (Max): NotRequiredMHz; Number of  Elements: 1; Gate-Source Voltage (Max): ?12V; Channel Mode: Enhancement; Drain-Source On-Res: 0.044ohm; Type: PowerMOSFET; Polarity: NPN; Rds On Max: 50mR; Input Capacitance: 645pF; Max Power Dissipation: 1.4W; Collector Base Voltage (VCBO): 60V; Collector Emitter Breakdown Voltage: 40V; Collector Emitter Saturation Voltage: 300mV; Current Rating: 200mA; Element Configuration: Single; Emitter Base Voltage (VEBO): 6V; Frequency: 300MHz; hFE Min: 100; Package URL: http://www.aosmd.com/res/packaging_information/SOT-23-3L.pdf; Datasheet URL: http://www.aosmd.com/res/data_sheets/AO3401A.pdf; Package Type: SOT-23; Drain-Source On-Volt: 30V; Package Description: 3-Pin Small Outline Transistor, Body 2.95 x 1.6 mm, Pitch 0.95 mm; Mounting: SurfaceMount; Drain Current (Max): 4A; Manufacturer URL: http://www.aosmd.com/; Continuous Drain Current: 4A; Package Reference: SOT-23-3L; Mounting Technology: SurfaceMount; Operating Temperature Classification: Military; Power Gain: NotRequireddB; Datasheet Version: Rev. 3, 03/2011; Operating Temp Range: -55Cto150C; Pin Count: 3; Part Name: Tran-0001; LCSC Part Number: C15127; Supplier 1: Digi-Key; Supplier Part Number 1: AO3401AL-ND; RoHS: Yes; Mount: Surface Mount; Case/Package: SOT-23-3; Min Operating Temperature: -55°C; Max Operating Temperature: 150°C; Packaging: Tape and Reel; Drain to Source Voltage (Vdss): 30V; Continuous Drain Current (ID): 4A; ComponentLink1URL: https://media.digikey.com/pdf/Data%20Sheets/A; ComponentLink1Description: https://media.digikey.com/pdf/Data%20Sheets/A; Category: BJTs; Collector Emitter Voltage (VCEO): 40V; ComponentLink2Description: https://datasheet.ciiva.com/7972/2n3904-79726; ComponentLink2URL: https://datasheet.ciiva.com/7972/2n3904-79726; ComponentLink3Description: https://datasheet.ciiva.com/22653/1922793-226; ComponentLink3URL: https://datasheet.ciiva.com/22653/1922793-226; ComponentLink4Description: https://datasheet.ciiva.com/11201/mmbt3904-11; ComponentLink4URL: https://datasheet.ciiva.com/11201/mmbt3904-11; ComponentLink5Description: https://datasheet.ciiva.com/16850/mmbt3904-16; ComponentLink5URL: https://datasheet.ciiva.com/16850/mmbt3904-16; ComponentLink6Description: https://datasheet.ciiva.com/971/mmbt3904-9718; ComponentLink6URL: https://datasheet.ciiva.com/971/mmbt3904-9718; ComponentLink7Description: https://datasheet.ciiva.com/971/mmbt3904-9718; ComponentLink7URL: https://datasheet.ciiva.com/971/mmbt3904-9718; ComponentLink8Description: https://datasheet.ciiva.com/971/mmbt3904-9718; ComponentLink8URL: https://datasheet.ciiva.com/971/mmbt3904-9718; Contact Plating: Tin,Matte; Gain Bandwidth Product: 300MHz; Height: 0.25inch; Lead Free: Lead Free; Length: 0.25inch; Max Breakdown Voltage: 40V; Max Collector Current: 200mA; Max Frequency: 300MHz; Number of Elements: 1; Number of Pins: 3; Package Quantity: 1; Pricing 1: 1=0.03200, 10=0.02500, 100=0.01700, 500=0.017; Radiation Hardening: No; REACH SVHC: No SVHC; RoHS Compliant: Yes; Termination: SMD/SMT; Transition Frequency: 300MHz; Voltage Rating (DC): 40V; Weight: 0.03g; Width: 0.25inch
Q7 Q9 Q10 = Tran-0002: Trans GP BJT NPN 60V 0.2A 350mW Automotive 3-Pin SOT-23 T/R; Manufacturer: ON Semiconductor / Fairchild; Manufacturer: ON Semiconductor; Elements: 1; Power: 225mW; Frequency: 250MHz; Vce Max: 300mV; Max Collector Current: 200mA; Collector-emitter Voltage-Max: 400mV; Mounting Technology: SM; Min Operating Temperature: -55°C; Datasheet URL: http://www.onsemi.cn/pub_link/Collateral/MMBT3904LT1-D.PDF; Pins: 3; Package Description: 3-Pin Small Outline Transistor, Body 2.9 x 1.3 mm, Pitch 0.95 mm; Max Operating Temperature: 150°C; Package Reference: SOT-23 (318-08); RoHS Compliant: Yes; Datasheet Version: Rev. 12, 11/2012; Case/Package: SOT-23-3; Manufacturer Part Number: MMBT3904; Component Type: Transistors; Part Name: Tran-0002; LCSC Part Number: C20526; Supplier 1: Newark; Supplier Part Number 1: 58K9431; RoHS: Yes; Mount: Surface Mount; ComponentLink1URL: https://datasheet.ciiva.com/22664/1708270-226; ComponentLink1Description: https://datasheet.ciiva.com/22664/1708270-226; Polarity: NPN; Number of Elements: 1; Max Frequency: 250MHz; Length: 2.9mm; Width: 1.3mm; Height: 0.94mm; Radiation Hardening: No; Lead Free: Lead Free; REACH SVHC: No SVHC; ComponentLink2URL: https://datasheet.ciiva.com/4721/mmbt3906lt1-; ComponentLink2Description: https://datasheet.ciiva.com/4721/mmbt3906lt1-; ComponentLink3URL: https://datasheet.ciiva.com/11201/mmbt3906lt1; ComponentLink3Description: https://datasheet.ciiva.com/11201/mmbt3906lt1; ComponentLink4URL: https://datasheet.ciiva.com/16387/mmbt3906lt1; ComponentLink4Description: https://datasheet.ciiva.com/16387/mmbt3906lt1; ComponentLink5URL: https://datasheet.ciiva.com/976/mmbt3906lt1-d; ComponentLink5Description: https://datasheet.ciiva.com/976/mmbt3906lt1-d; ComponentLink6URL: https://datasheet.ciiva.com/976/mmbt3906lt1-d; ComponentLink6Description: https://datasheet.ciiva.com/976/mmbt3906lt1-d; ComponentLink7URL: https://datasheet.ciiva.com/976/mmbt3906lt1-d; ComponentLink7Description: https://datasheet.ciiva.com/976/mmbt3906lt1-d; Series: -
R88 R90 R92 R94 R99 R100 R102-R104 R108 = Res-00002: Thick Film 0402 10K OHM 1% 1/16W 0402; Manufacturer: Yageo; Manufacturer Part Number: RC0402FR-0710KP; Max Power Dissipation: 63mW; Temperature Coefficient: 150ppm/°C; Power Rating: 62.5mW; Part Name: Res-00002; Supplier 1: Digi-Key; Supplier Part Number 1: YAG1249CT-ND; RoHS: Yes; Category: Chip SMD Resistors; Stock 1: 161500; Pricing 1: 1=0.10000, 10=0.03600, 100=0.01450, 1000=0.00; Case/Package: 0402; Case Code (Metric): 1005; Case Code (Imperial): 0402; Min Operating Temperature: -55°C; Max Operating Temperature: 155°C; Packaging: Tape and Reel; Resistance: 10k; Resistor Type: Thick Film; Number of Terminations: 2; Tolerance: 1%; Features: Moisture Resistant; Length: 0.039inch; Width: 0.02inch; Height: 0.016inch; RoHS Compliant: Yes; ComponentLink1URL: http://www.yageo.com/NewPortal/yageodocoutput; ComponentLink1Description: http://www.yageo.com/NewPortal/yageodocoutput; LCSC Part Number: C25744; Mount: Surface Mount
R89 R101 R113 = Res-00004: Thick Film 0402 5.1K Ohm 1% 1/16W 0402; Manufacturer: Stackpole Electronics; Manufacturer Part Number: RMCF0402FT5K10; Max Power Dissipation: 63mW; Temperature Coefficient: 100ppm/°C; Power Rating: 62.5mW; Part Name: Res-00004; Supplier 1: Digi-Key; Supplier Part Number 1: RMCF0402FT5K10CT-ND; RoHS: Yes; Category: Chip SMD Resistors; Stock 1: 131490; Pricing 1: 1=0.10000, 10=0.01500, 100=0.00610, 1000=0.00; Case/Package: 0402; Case Code (Metric): 1005; Case Code (Imperial): 0402; Min Operating Temperature: -55°C; Max Operating Temperature: 155°C; Packaging: Tape and Reel; Resistance: 5.1k; Resistor Type: Thick Film; Number of Terminations: 2; Tolerance: 1%; Features: Automotive AEC-Q200; Length: 0.039inch; Width: 0.02inch; Height: 0.016inch; RoHS Compliant: Yes; ComponentLink1URL: http://components.arrow.com/part/dataview/513; ComponentLink1Description: http://components.arrow.com/part/dataview/513; ComponentLink2URL: https://www.seielect.com/catalog/SEI-RMCF_RMC; ComponentLink2Description: https://www.seielect.com/catalog/SEI-RMCF_RMC; ComponentLink3URL: https://www.seielect.com/catalog/SEI-Packagin; ComponentLink3Description: https://www.seielect.com/catalog/SEI-Packagin; ComponentLink4URL: https://datasheet.ciiva.com/15193/getdatashee; ComponentLink4Description: https://datasheet.ciiva.com/15193/getdatashee; LCSC Part Number: C25905; Mount: Surface Mount; Contact Plating: Tin,Matte; Series: RMCF; Radiation Hardening: No; Size Code: 0402; Construction: Rectangular; Depth: 0.5mm; Military Standard: Not; Lead Free: Lead Free
R93 R106 R107 = Res-00008: Thick Film 0402 2.8K Ohm 1% 0.063W ±100ppm/°C Molded SMD Paper T/R; Manufacturer: Stackpole Electronics; Manufacturer Part Number: RMCF0402FT2K80; Resistance: 2.8kR; Max Power Dissipation: 63mW; Power Rating: 62.5mW; Part Name: Res-00008; Supplier 1: Digi-Key; Supplier Part Number 1: RMCF0402FT2K80CT-ND; RoHS: Yes; Category: Chip SMD Resistors; Stock 1: 141882; Pricing 1: 1=0.10000, 10=0.01500, 100=0.00610, 1000=0.00; Case/Package: 0402; Case Code (Metric): 1005; Case Code (Imperial): 0402; Min Operating Temperature: -55°C; Max Operating Temperature: 155°C; Packaging: Tape and Reel; Resistor Type: Thick Film; Number of Terminations: 2; Tolerance: 1%; Temperature Coefficient: 100ppm/°C; Features: Automotive AEC-Q200; Length: 0.039inch; Width: 0.02inch; Height: 0.016inch; RoHS Compliant: Yes; ComponentLink1URL: https://www.seielect.com/catalog/SEI-RMCF_RMC; ComponentLink1Description: https://www.seielect.com/catalog/SEI-RMCF_RMC; ComponentLink2URL: https://www.seielect.com/Catalog/SEI-RMCF_RMC; ComponentLink2Description: https://www.seielect.com/Catalog/SEI-RMCF_RMC; ComponentLink3URL: https://www.seielect.com/catalog/SEI-Packagin; ComponentLink3Description: https://www.seielect.com/catalog/SEI-Packagin; LCSC Part Number: C62741; Mount: Surface Mount; Contact Plating: Tin,Matte; Series: RMCF; Radiation Hardening: No; Lead Free: Lead Free
R96 R105 R109 = Res-00003: Thick Film 0402 100K OHM 1% 1/16W 0402; Manufacturer: Stackpole Electronics; Manufacturer Part Number: RMCF0402FT100K; Power Rating: 62.5mW; Part Name: Res-00003; Supplier 1: Digi-Key; Supplier Part Number 1: RMCF0402FT100KCT-ND; RoHS: Yes; Category: Chip SMD Resistors; Stock 1: 13703190; Pricing 1: 1=0.10000, 10=0.01500, 100=0.00610, 1000=0.00; Case/Package: 0402; Case Code (Metric): 1005; Case Code (Imperial): 0402; LCSC Part Number: C25741; Mount: Surface Mount; Contact Plating: Tin,Matte
R97 R98 = Res-00005: Thick Film  220 OHM 5% 1W 2512; Manufacturer: Stackpole Electronics; Manufacturer Part Number: RMCF2512JT220R; Temperature Coefficient: 200ppm/°C; Part Name: Res-00005; Supplier 1: Digi-Key; Supplier Part Number 1: RMCF2512JT220RCT-ND; RoHS: Yes; Category: Chip SMD Resistors; Stock 1: 85; Pricing 1: 1=0.30000, 10=0.25300, 100=0.09890, 1000=0.04; Case/Package: 2512; Case Code (Metric): 6432; Case Code (Imperial): 2512; Min Operating Temperature: -55°C; Max Operating Temperature: 155°C; Packaging: Tape and Reel; Resistance: 220R; Resistor Type: Thick Film; Number of Terminations: 2; Tolerance: 5%; Max Power Dissipation: 1W; Features: Automotive AEC-Q200; Length: 0.248inch; Width: 0.126inch; Height: 0.028inch; RoHS Compliant: Yes; ComponentLink1URL: https://datasheet.ciiva.com/15193/getdatashee; ComponentLink1Description: https://datasheet.ciiva.com/15193/getdatashee; LCSC Part Number: C38808; Mount: Surface Mount; Contact Plating: Tin,Matte; Power Rating: 1W; Series: RMCF; Radiation Hardening: No; Size Code: 2512; Construction: Rectangular; Depth: 3.2mm; Military Standard: Not; Lead Free: Lead Free
R110 = Res-00010: Thick Film 0402 680 Ohm 1% 0.063W(1/16W) ±100ppm/C Pad SMD Automotive T/R; Manufacturer: Stackpole Electronics; Manufacturer Part Number: RMCF0402FT680R; Max Power Dissipation: 63mW; Temperature Coefficient: 100ppm/°C; Power Rating: 62.5mW; Part Name: Res-00010; Supplier 1: Digi-Key; Supplier Part Number 1: RMCF0402FT680RCT-ND; RoHS: Yes; Category: Chip SMD Resistors; Stock 1: 143190; Pricing 1: 1=0.10000, 10=0.01500, 100=0.00610, 1000=0.00; Case/Package: 0402; Case Code (Metric): 1005; Case Code (Imperial): 0402; Min Operating Temperature: -55°C; Max Operating Temperature: 155°C; Packaging: Tape and Reel; Resistance: 680R; Resistor Type: Thick Film; Number of Terminations: 2; Tolerance: 1%; Features: Automotive AEC-Q200; Length: 0.039inch; Width: 0.02inch; Height: 0.016inch; RoHS Compliant: Yes; ComponentLink1URL: http://www.seielect.com/Catalog/SEI-RMCF_RMCP; ComponentLink1Description: http://www.seielect.com/Catalog/SEI-RMCF_RMCP; ComponentLink2URL: https://www.seielect.com/catalog/SEI-RMCF_RMC; ComponentLink2Description: https://www.seielect.com/catalog/SEI-RMCF_RMC; ComponentLink3URL: https://www.seielect.com/Catalog/SEI-RMCF_RMC; ComponentLink3Description: https://www.seielect.com/Catalog/SEI-RMCF_RMC; ComponentLink4URL: https://www.seielect.com/catalog/SEI-Packagin; ComponentLink4Description: https://www.seielect.com/catalog/SEI-Packagin; LCSC Part Number: C25130; Mount: Surface Mount; Contact Plating: Tin,Matte; Series: RMCF; Radiation Hardening: No; Package Quantity: 10000
U4 = LDO-0003: IC REG LDO 5V 1.5A D2PAK; Manufacturer 1: STMicroelectronics; Max Input Voltage: 35V; Number of Outputs: 1; Polarity: Positive; Quiescent Current: 8mA; Output Type: Fixed; Min Input Voltage: 10V; Dropout Voltage: 2V; Min Output Voltage: 4.8V; Power Supply Rejection Ratio (PSRR): 62dB; Part Name: LDO-0003; Manufacturer Part Number 1: L7805CD2T-TR; Supplier 1: Digi-Key; Supplier Part Number 1: 497-1171-2-ND; Supplier 2: LCSC; Supplier Part Number 2: C15077; Pricing 1: 1=1.02000, 10=0.91100, 25=0.86480, 100=0.7104; Supplier 3: Newark; Supplier Part Number 3: 95M4314; RoHS: Yes; Category: Voltage Regulators - Linear; Manufacturer: STMicroelectronics; Manufacturer Part Number: L7805CD2T-TR; Stock 1: 30; Mount: Surface Mount; Case/Package: TO-263; Number of Pins: 3; Weight: 7.1E-05oz; Contact Plating: Tin,Matte; Min Operating Temperature: 0°C; Max Operating Temperature: 125°C; Output Voltage: 5V; Max Output Current: 1.5A; Output Current: 1.5A; Packaging: Tape and Reel; Package Quantity: 1000; Nominal Output Voltage: 5V; Number of Regulators: 1; Series: -; Length: 10.4mm; Width: 9.35mm; Height: 4.6mm; Radiation Hardening: No; REACH SVHC: No SVHC; Lead Free: Lead Free; RoHS Compliant: Yes; LCSC Part Number: C15077